# Altium schematic sheet [02] MCU.SchDoc
size A4
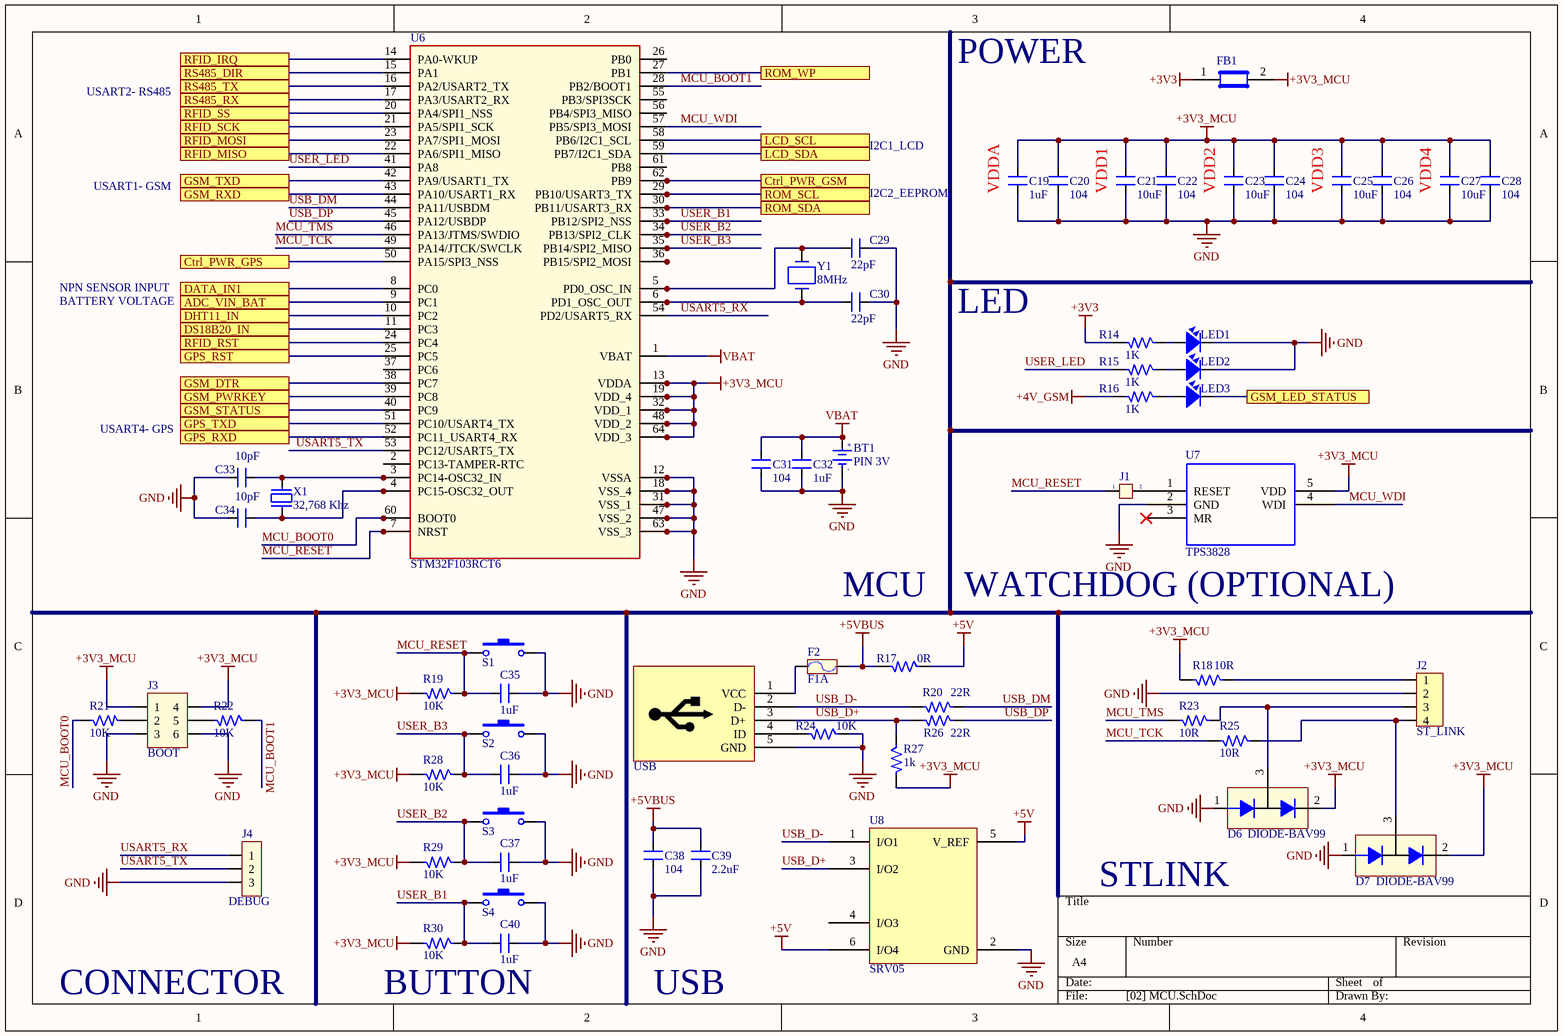
[diagram p0: [02] MCU.SchDoc]

## Parts
BT1  PIN 3V  [CR1220 SMD]
C19  1uF  [C0603 SMT]
C20  104  [C0603 SMT]
C21  10uF  [C0603 SMT]
C22  104  [C0603 SMT]
C23  10uF  [C0603 SMT]
C24  104  [C0603 SMT]
C25  10uF  [C0603 SMT]
C26  104  [C0603 SMT]
C27  10uF  [C0603 SMT]
C28  104  [C0603 SMT]
C29  22pF  [C0603 SMT]
C30  22pF  [C0603 SMT]
C31  104  [C0603 SMT]
C32  1uF  [C0603 SMT]
C33  10pF  [C0603 SMT]
C34  10pF  [C0603 SMT]
C35  1uF  [CAP_0805]
C36  1uF  [CAP_0805]
C37  1uF  [CAP_0805]
C38  104  [C0603 SMT]
C39  2.2uF  [RES-SMD-1210]
C40  1uF  [CAP_0805]
D6  DIODE-BAV99  [SOT23]
D7  DIODE-BAV99  [SOT23]
F2  F1A  [RES-SMD-1812]
FB1  BLM21PG600SN1D  [R0805]  (value not drawn)
J1  watdog  [JP2]  (value not drawn)
J2  ST_LINK  [CON_4P]
J3  BOOT  [JP3x2]
J4  DEBUG  [JP3]
LED1  LED  [LED-0805-Green]  (value not drawn)
LED2  LED  [LED-0805-Yellow]  (value not drawn)
LED3  LED  [LED-0805-Red]  (value not drawn)
R14  1K  [RES-SMD-0805]
R15  1K  [RES-SMD-0805]
R16  1K  [RES-SMD-0805]
R17  0R  [RES-SMD-0805]
R18  10R  [RES-SMD-0805]
R19  10K  [RES-SMD-0805]
R20  22R  [RES-SMD-0603]
R21  10K  [R0603 -SMT]
R22  10K  [R0603 -SMT]
R23  10R  [RES-SMD-0805]
R24  10K  [RES-SMD-0603]
R25  10R  [RES-SMD-0805]
R26  22R  [RES-SMD-0603]
R27  1k  [RES-SMD-0603]
R28  10K  [RES-SMD-0805]
R29  10K  [RES-SMD-0805]
R30  10K  [RES-SMD-0805]
S1  SW-SMD  [SW-SMD]  (value not drawn)
S2  SW-SMD  [BUTTON NGHIENG]  (value not drawn)
S3  SW-SMD  [BUTTON NGHIENG]  (value not drawn)
S4  SW-SMD  [BUTTON NGHIENG]  (value not drawn)
U6  STM32F103RCT6  [LQFP-64]
U7  TPS3828  [TPS3828]
U8  SRV05  [SOT23-6]
USB  USB  [USB-B-Mini]  (value not drawn)
X1  32,768 Khz  [XT32kn]
Y1  8MHz  [ABM7_v1_1_BIG]

## Ports
ADC_VIN_BAT, Ctrl_PWR_GPS, Ctrl_PWR_GSM, DATA_IN1, DHT11_IN, DS18B20_IN, GPS_RST, GPS_RXD, GPS_TXD, GSM_DTR, GSM_LED_STATUS, GSM_PWRKEY, GSM_RXD, GSM_STATUS, GSM_TXD, LCD_SCL, LCD_SDA, RFID_IRQ, RFID_MISO, RFID_MOSI, RFID_RST, RFID_SCK, RFID_SS, ROM_SCL, ROM_SDA, ROM_WP, RS485_DIR, RS485_RX, RS485_TX

## Nets
+3V3: FB1.1 R14.2
+3V3_MCU: C19.2 C20.2 C21.2 C22.2 C23.2 C24.2 C25.2 C26.2 C27.2 C28.2 D6.2 D7.2 FB1.2 J3.1 J3.4 R18.2 R19.2 R27.2 R28.2 R29.2 R30.2 U6.13(VDDA) U6.19(VDD_4) U6.32(VDD_1) U6.48(VDD_2) U6.64(VDD_3) U7.5(VDD)
+4V_GSM: R16.2
+5V: R17.1 U8.5(V_REF) U8.6(I/O4)
+5VBUS: C38.2 C39.2 F2.2 R17.2
GND: BT1.2(GND) C19.1 C20.1 C21.1 C22.1 C23.1 C24.1 C25.1 C26.1 C27.1 C28.1 C29.2 C30.2 C31.1 C32.1 C33.2 C34.2 C35.2 C36.2 C37.2 C38.1 C39.1 C40.2 D6.1 D7.1 J2.2 J3.3 J3.6 J4.3 LED1.2 LED2.2 R24.1 S1.2 S2.2 S3.2 S4.2 U6.12(VSSA) U6.18(VSS_4) U6.31(VSS_1) U6.47(VSS_2) U6.63(VSS_3) U7.2(GND) U8.2(GND) USB.5(GND)
VBAT: BT1.1(+3V) C31.2 C32.2 U6.1(VBAT)
ADC_VIN_BAT: U6.9(PC1) ; port ADC_VIN_BAT
Ctrl_PWR_GPS: U6.50(PA15/SPI3_NSS) ; port Ctrl_PWR_GPS
Ctrl_PWR_GSM: U6.62(PB9) ; port Ctrl_PWR_GSM
DATA_IN1: U6.8(PC0) ; port DATA_IN1
DHT11_IN: U6.10(PC2) ; port DHT11_IN
DS18B20_IN: U6.11(PC3) ; port DS18B20_IN
GPS_RST: U6.25(PC5) ; port GPS_RST
GPS_RXD: U6.52(PC11_USART4_RX) ; port GPS_RXD
GPS_TXD: U6.51(PC10/USART4_TX) ; port GPS_TXD
GSM_DTR: U6.38(PC7) ; port GSM_DTR
GSM_LED_STATUS: LED3.2 ; port GSM_LED_STATUS
GSM_PWRKEY: U6.39(PC8) ; port GSM_PWRKEY
GSM_RXD: U6.43(PA10/USART1_RX) ; port GSM_RXD
GSM_STATUS: U6.40(PC9) ; port GSM_STATUS
GSM_TXD: U6.42(PA9/USART1_TX) ; port GSM_TXD
LCD_SCL: U6.58(PB6/I2C1_SCL) ; port LCD_SCL
LCD_SDA: U6.59(PB7/I2C1_SDA) ; port LCD_SDA
MCU_BOOT0: R21.1 U6.60(BOOT0)
MCU_BOOT1: R22.1 U6.28(PB2/BOOT1)
MCU_RESET: C35.1 J1.1 R19.1 S1.1 U6.7(NRST)
MCU_TCK: R25.2 U6.49(PA14/JTCK/SWCLK)
MCU_TMS: R23.2 U6.46(PA13/JTMS/SWDIO)
MCU_WDI: U6.57(PB5/SPI3_MOSI) U7.4(WDI)
RFID_IRQ: U6.14(PA0-WKUP) ; port RFID_IRQ
RFID_MISO: U6.22(PA6/SPI1_MISO) ; port RFID_MISO
RFID_MOSI: U6.23(PA7/SPI1_MOSI) ; port RFID_MOSI
RFID_RST: U6.24(PC4) ; port RFID_RST
RFID_SCK: U6.21(PA5/SPI1_SCK) ; port RFID_SCK
RFID_SS: U6.20(PA4/SPI1_NSS) ; port RFID_SS
ROM_SCL: U6.29(PB10/USART3_TX) ; port ROM_SCL
ROM_SDA: U6.30(PB11/USART3_RX) ; port ROM_SDA
ROM_WP: U6.27(PB1) ; port ROM_WP
RS485_DIR: U6.15(PA1) ; port RS485_DIR
RS485_RX: U6.17(PA3/USART2_RX) ; port RS485_RX
RS485_TX: U6.16(PA2/USART2_TX) ; port RS485_TX
USART5_RX: J4.1 U6.54(PD2/USART5_RX)
USART5_TX: J4.2 U6.53(PC12/USART5_TX)
USB_D+: R26.2 R27.1 U8.3(I/O2) USB.3(D+)
USB_D-: R20.2 U8.1(I/O1) USB.2(D-)
USB_DM: R20.1 U6.44(PA11/USBDM)
USB_DP: R26.1 U6.45(PA12/USBDP)
USER_B1: C40.1 R30.1 S4.1 U6.33(PB12/SPI2_NSS)
USER_B2: C37.1 R29.1 S3.1 U6.34(PB13/SPI2_CLK)
USER_B3: C36.1 R28.1 S2.1 U6.35(PB14/SPI2_MISO)
USER_LED: R15.2 U6.41(PA8)
NetC29_1: C29.1 U6.5(PD0_OSC_IN) Y1.2
NetC30_1: C30.1 U6.6(PD1_OSC_OUT) Y1.1
NetC33_1: C33.1 U6.3(PC14-OSC32_IN) X1.1
NetC34_1: C34.1 U6.4(PC15-OSC32_OUT) X1.2
NetD6_3: D6.3 J2.3 R23.1
NetD7_3: D7.3 J2.4 R25.1
NetF2_1: F2.1 USB.1(VCC)
NetJ1_2: J1.2 U7.1(RESET)
NetJ2_1: J2.1 R18.1
NetJ3_2: J3.2 R21.2
NetJ3_5: J3.5 R22.2
NetLED1_1: LED1.1 R14.1
NetLED2_1: LED2.1 R15.1
NetLED3_1: LED3.1 R16.1
NetR24_2: R24.2 USB.4(ID)

Not connected (* = marked no-connect by the designer): U6 2(PC13-TAMPER-RTC) 26(PB0) 36(PB15/SPI2_MOSI) 37(PC6) 55(PB3/SPI3SCK) 56(PB4/SPI3_MISO) 61(PB8); U7 3(MR)*; U8 4(I/O3)

## Notes on the sheet
- USART2- RS485
- POWER
- I2C1_LCD
- USART1- GSM
- (near C29) I2C2_EEPROM
- (near C19) VDDA
- (near C21) VDD1
- (near C23) VDD2
- (near C25) VDD3
- (near C27) VDD4
- NPN SENSOR INPUT
- BATTERY VOLTAGE
- LED
- USART4- GPS
- MCU
- WATCHDOG (OPTIONAL)
- (near D6) STLINK
- CONNECTOR
- BUTTON
- USB
- (in symbol PIN 3V) +; -

## Library data of the parts
BT1 = PIN 3V: Battery 3VDC; Value: PIN 3V
C19-C40 = CM: Cap SMD; Value: 103
D6 D7 = DIODE-BAV99: ZENER, SOT23,; Manufacturer: ON Semiconductor / Fairchild; Manufacturer Part Number: BAV99; .Creator: LeKhaLinh; Other Drawings: Diode Circuit; PCN Design/Specification: Mold Compound 12/Dec/2007; PCN Assembly/Origin: SOT23 Manufacturing Source 31/May2013 / Assembly Site Addition 20/Jul/2015; PCN Packaging: Binary Year Code Marking 15/Jan/2014; Diode Configuration: 1 Pair Series Connection; Diode Type: Standard; Voltage - DC Reverse (Vr) (Max): 70V; Current - Average Rectified (Io) (per Diode): 200mA; Voltage - Forward (Vf) (Max) @ If: 1.25V @ 150mA; Speed: Small Signal =; Reverse Recovery Time (trr): 6ns; Current - Reverse Leakage @ Vr: 2.5µA @ 70V; Online Catalog: Diode Array; Other Names: BAV99FSDKR; .CheckPCB: LeKhaLinh; .CheckSCH: LeKhaLinh; Supplier 1: Digi-Key; Stock 1: 1165; Pricing 1: 1=0.26, 10=0.21, 100=0.1115, 500=0.0734, 1000=0.0499 (USD); Standard Package: 1; Category: Discrete Semiconductor Products; Family: Diodes, Rectifiers - Arrays; Packaging: Digi-Reel®; Mounting Type: Surface Mount; Package / Case: TO-236-3, SC-59, SOT-23-3; Supplier Device Package: SOT-23-3 (TO-236); ComponentLink1URL: https://www.fairchildsemi.com/package-drawings/MA/MA03B.pdf?src-supplier=Digi-Key; ComponentLink1Description: https://www.fairchildsemi.com/package-drawings/MA/MA03B.pdf?src-supplier=Digi-Key; ComponentLink2URL: http://www.farnell.com/datasheets/1822674.pdf?src-supplier=Element14; ComponentLink2Description: http://www.farnell.com/datasheets/1822674.pdf?src-supplier=Element14; ComponentLink3URL: http://www.mouser.com/ds/2/149/BAV99-22788.pdf?src-supplier=Mouser; ComponentLink3Description: http://www.mouser.com/ds/2/149/BAV99-22788.pdf?src-supplier=Mouser; ComponentLink4URL: http://www.fairchildsemi.com/ds/BA/BAV99.pdf?src-supplier=Avnet+Europe; ComponentLink4Description: http://www.fairchildsemi.com/ds/BA/BAV99.pdf?src-supplier=Avnet+Europe; ComponentLink5URL: https://www.verical.com/server-webapp/html/getDatasheet?partID=110217&src-supplier=Verical; ComponentLink5Description: https://www.verical.com/server-webapp/html/getDatasheet?partID=110217&src-supplier=Verical; ComponentLink6URL: http://www.farnell.com/datasheets/2304409.pdf?src-supplier=Element14; ComponentLink6Description: http://www.farnell.com/datasheets/2304409.pdf?src-supplier=Element14; Supplier 2: Mouser; Stock 2: 0; Supplier 3: Arrow; Stock 3: 5700; Pricing 3: 1=0.1933, 10=0.1873, 25=0.1555, 100=0.0806, 250=0.0724, 500=0.0523, 1000=0.0428, 3000=0.0342 (USD); Supplier Part Number 1: BAV99FSCT-ND; Supplier Part Number 2: 512-BAV99; Supplier Part Number 3: BAV99
F2 = Fuse: Designed by: VanDungEvn; Value: Fuse
FB1 = Ferrite Bead
J1 = JP 2: Jumper 2; Value: JP 2
J2 = Header4: Header IDC, 4 x 1 Pin Vertical 2.54mm Pitch (Non-Boxed, Male); Manufacturer: W¨¹rth Elektronik eiSos GmbH; partNo: 613002143121; ComponentLink1 Description: Manufacturer; ComponentLink2 Description: Datasheet; NoPins: 02; Created Date: 29 March 2013; ComponentLink1URL: http://www.we-online.com; ComponentLink2URL: http://katalog.we-online.de/em/datasheet/6130xx143121.pdf; Created by: Karrer Zheng
J3 = JP3x2: Connector 3x2; Value: Connector 3x2
J4 = JP3: Jumper 3; Value: J3
LED1-LED3 = LED: LED Single colour Green and Red; Value: LED 3 ly Single Colour
R14-R16 R27 = RM: Resistor SMD; Value: 1K
R17-R26 R28-R30 = RM: Resistor SMD; Value: 1K
S1-S4 = SW-SMD: Switch; Published: 24-Mar-1999; LatestRevisionDate: 17-Jul-2002; LatestRevisionNote: Re-released for DXP Platform.; PackageReference: SPST-2; Publisher: Altium Limited
U6 = STM32F103RCT6: MCU 32BIT 256KB FLASH 64LQFP
U8 = SRV05: TVS DIODE 5V
USB = USB-M
X1 = XT32k: Crystal 32,768kHz for timer real; Value: 32,768khz
Y1 = ABM7-16.000MHZ-D2Y-T: CRYSTAL 16MHZ 18PF SMD; Manufacturer: Abracon LLC; Frequency Stability: ±30ppm; Frequency Tolerance: ±20ppm; ESR (Equivalent Series Resistance): 50 Ohm; Operating Mode: Fundamental; .Creator: MM; .Checked PCB: RF; Supplier 1: Digi-Key; Manufacturer Part Number: ABM7-16.000MHZ-D2Y-T; RoHS: RoHS Compliant; Category: Crystals and Oscillators; Stock 1: 5861; Pricing 1: 1=0.96, 10=0.847, 50=0.791, 100=0.7, 500=0.6615 (USD); Packaging: Cut Tape (CT); Type: MHz Crystal; Frequency: 16MHz; Load Capacitance: 18pF; Operating Temperature: -40°C ~ 85°C; Ratings: -; Mounting Type: Surface Mount; Package / Case: 2-SMD; Size / Dimension: 0.236" L x 0.138" W (6.00mm x 3.50mm); Height: 0.055" (1.40mm); ComponentLink1URL: http://www.abracon.com/Resonators/abm7.pdf; ComponentLink1Description: http://www.abracon.com/Resonators/abm7.pdf; Supplier Part Number 1: 535-9840-1-ND; .Checked SCH: RF